# Altium schematic sheet FPGA_Config.SchDoc: FPGA
size 420 x 297 mm; Author: G.K.; CompanyName: WUT; DrawnBy: G.K.; Organization: CERN; Address1: Warsaw Univeristy of Technology; Address2: Nowowiejska 15/19; DocumentNumber: 9; Revision: -; SheetNumber: 9; SheetTotal: 10; EDA_Number: ARTIQ; Projet: Banker; ModifiedBy: -; CreateDate: XX/XX/XXXX; CheckedDate: -; Title2: Configuration; DivGrp: ISE; Designer: G.K.; ModifiedDate: -; ProjectName: ADC/DAC MEZZANINE
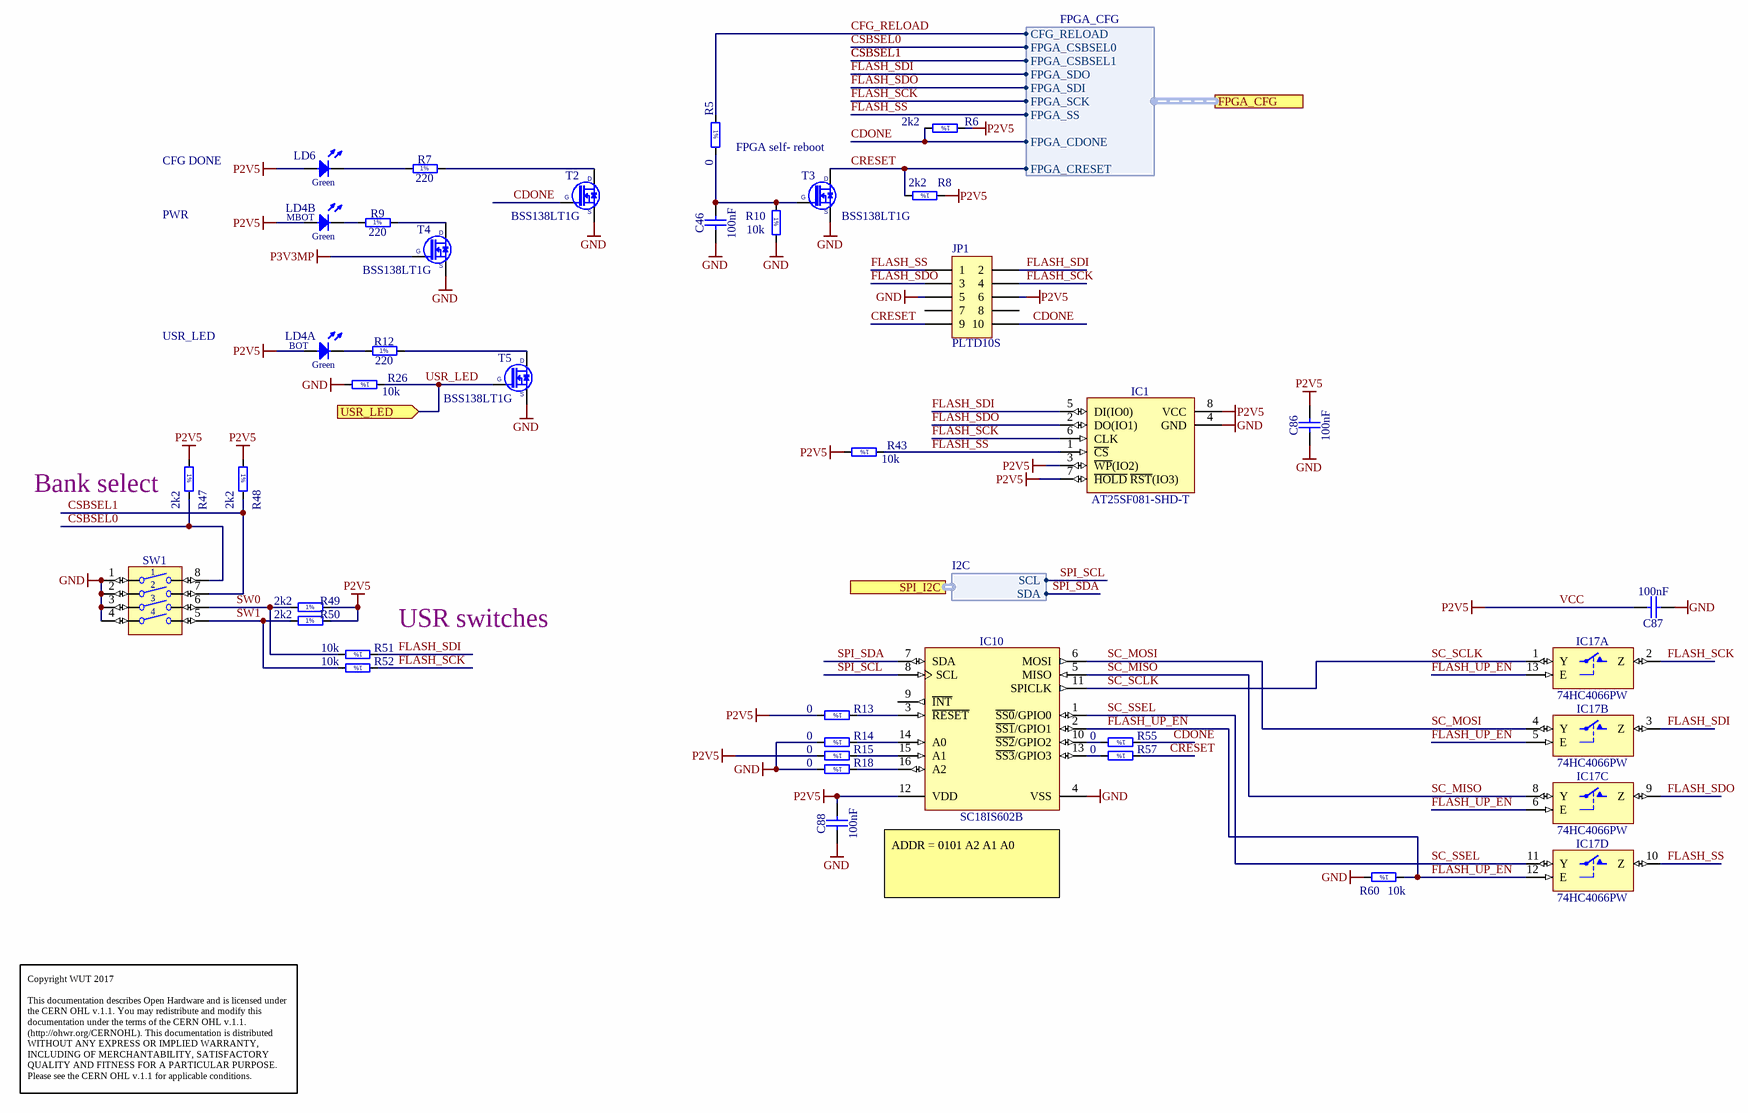
[diagram p0: FPGA_Config.SchDoc]

## Parts
C46  100nF  [CAPC1005X55N]
C86  100nF  [CAPC1005X55N]
C87  100nF  [CAPC1005X55N]
C88  100nF  [CAPC1005X55N]
IC1  AT25SF081-SHD-T  [SOIC127P790X216-8N]
IC10  SC18IS602B  [SOP65P640X110-16N]
IC17  74HC4066PW  [SOP65P640X110-14N]  (parts A,B,C,D of 4)
JP1  PLTD10S  [PLTD10S]
LD4  Green/Green/HeRed/HeRed  [LED_BIVAR_H485CHHGGDL]  (value not drawn)  (parts A,B of 4)
LD6  Green  [LED_KINGBRIGHT_KPH-1608CGCK]  (value not drawn)
R5  0  [RESC1608X55N]
R6  2k2  [RESC1005X40N]
R7  220  [RESC1608X55N]
R8  2k2  [RESC1005X40N]
R9  220  [RESC1608X55N]
R10  10k  [RESC1005X40N]
R12  220  [RESC1608X55N]
R13  0  [RESC1608X55N]
R14  0  [RESC1608X55N]
R15  0  [RESC1608X55N]
R18  0  [RESC1608X55N]
R26  10k  [RESC1005X40N]
R43  10k  [RESC1005X40N]
R47  2k2  [RESC1005X40N]
R48  2k2  [RESC1005X40N]
R49  2k2  [RESC1005X40N]
R50  2k2  [RESC1005X40N]
R51  10k  [RESC1005X40N]
R52  10k  [RESC1005X40N]
R55  0  [RESC1608X55N]
R57  0  [RESC1608X55N]
R60  10k  [RESC1005X40N]
SW1  Switch  [SW_TYCO_1571983-4]  (value not drawn)
T2  BSS138LT1G  [SOT95P240X110-3N]
T3  BSS138LT1G  [SOT95P240X110-3N]
T4  BSS138LT1G  [SOT95P240X110-3N]
T5  BSS138LT1G  [SOT95P240X110-3N]

## Ports
FPGA_CFG (harness FPGA_CFG), SPI_I2C (harness I2C), USR_LED (in)

## Harnesses
I2C: SDA, SCL
FPGA_CFG: FPGA_CSBSEL0, FPGA_CSBSEL1, FPGA_SDO, FPGA_SDI, FPGA_SCK, FPGA_SS, FPGA_CDONE, FPGA_CRESET, CFG_RELOAD

## Nets
GND: C46.1 C86.1 C87.1 C88.1 IC1.4(GND) IC10.4(VSS) IC17.7(GND) JP1.5 R10.2 R14.2 R18.2 R26.2 R60.2 SW1.1 SW1.2 SW1.3 SW1.4 T2.2(S) T3.2(S) T4.2(S) T5.2(S)
P3V3MP: T4.1(G)
VCC: C86.2 C87.2 C88.2 IC1.3(~{WP}(IO2)) IC1.7(~{HOLD}_~{RST}(IO3)) IC1.8(VCC) IC10.12(VDD) IC17.14(VCC) JP1.6 LD4.2(A) LD4.4(A) LD6.2(A) R6.1 R8.1 R13.2 R15.2 R43.2 R47.1 R48.1 R49.2 R50.2  [also labelled P2V5]
CDONE: JP1.10 R6.2 R55.1 T2.1(G) ; port FPGA_CFG.FPGA_CDONE
CFG_RELOAD: R5.1 ; port FPGA_CFG.CFG_RELOAD
CRESET: JP1.9 R8.2 R57.1 T3.3(D) ; port FPGA_CFG.FPGA_CRESET
CSBSEL0: R47.2 SW1.8 ; port FPGA_CFG.FPGA_CSBSEL0
CSBSEL1: R48.2 SW1.7 ; port FPGA_CFG.FPGA_CSBSEL1
FLASH_SCK: IC1.6(CLK) IC17.2(Z) JP1.4 R52.1 ; port FPGA_CFG.FPGA_SCK
FLASH_SDI: IC1.5(DI(IO0)) IC17.3(Z) JP1.2 R51.1 ; port FPGA_CFG.FPGA_SDO
FLASH_SDO: IC1.2(DO(IO1)) IC17.9(Z) JP1.3 ; port FPGA_CFG.FPGA_SDI
FLASH_SS: IC1.1(~{CS}) IC17.10(Z) JP1.1 R43.1 ; port FPGA_CFG.FPGA_SS
FLASH_UP_EN: IC10.2(~{SS1}/GPIO1) IC17.5(E) IC17.6(E) IC17.12(E) IC17.13(E) R60.1
SC_MISO: IC10.5(MISO) IC17.8(Y)
SC_MOSI: IC10.6(MOSI) IC17.4(Y)
SC_SCLK: IC10.11(SPICLK) IC17.1(Y)
SC_SSEL: IC10.1(~{SS0}/GPIO0) IC17.11(Y)
SPI_SCL: IC10.8(SCL) ; port SPI_I2C.SCL
SPI_SDA: IC10.7(SDA) ; port SPI_I2C.SDA
SW0: R49.1 R51.2 SW1.6
SW1: R50.1 R52.2 SW1.5
USR_LED: R26.1 T5.1(G) ; port USR_LED
NetC46_2: C46.2 R5.2 R10.1 T3.1(G)
NetIC10_3: IC10.3(~{RESET}) R13.1
NetIC10_10: IC10.10(~{SS2}/GPIO2) R55.2
NetIC10_13: IC10.13(~{SS3}/GPIO3) R57.2
NetIC10_14: IC10.14(A0) R14.1
NetIC10_15: IC10.15(A1) R15.1
NetIC10_16: IC10.16(A2) R18.1
NetLD4_1: LD4.1(C) R12.1
NetLD4_3: LD4.3(C) R9.1
NetLD6_1: LD6.1(C) R7.1
NetR7_2: R7.2 T2.3(D)
NetR9_2: R9.2 T4.3(D)
NetR12_2: R12.2 T5.3(D)

Not connected (* = marked no-connect by the designer): IC10 9(~{INT}); JP1 7 8

## Notes on the sheet
- CFG DONE
- PWR
- FPGA self- reboot
- USR_LED
- (near R47) Bank select
- USR switches
- ADDR = 0101 A2 A1 A0
- Copyright WUT 2017
  This documentation describes Open Hardware and is licensed under the CERN OHL v.1.1. You may redistribute and modify this documentation under the terms of the CERN OHL v.1.1. (http://ohwr.org/CERNOHL). This documentation is distributed WITHOUT ANY EXPRESS OR IMPLIED WARRANTY, INCLUDING OF MERCHANTABILITY, SATISFACTORY QUALITY AND FITNESS FOR A PARTICULAR PURPOSE. Please see the CERN OHL v.1.1 for applicable conditions.
- Project/Equipment
- Document
- Designer
- Drawn by
- Check.by
- File
- Last Mod.
- Print Date
- Sheet
- Size
- A3
- of
- Rev
- (in symbol LED_BIVAR_H485CHHGGDL, part A) BOT; Green
- (in symbol LED_BIVAR_H485CHHGGDL, part B) MBOT; Green
- (in symbol R0402_2K2_1%_0.0625W_100PPM) 1%
- (in symbol R0402_10K_1%_0.0625W_100PPM) 1%
- (in symbol R0603_0R_JUMPER) 1%
- (in symbol R0603_220R_1%_0.1W_100PPM) 1%

## Library data of the parts
C46 C86-C88 = CC0402_100NF_16V_10%_X5R: Non-polarised capacitor; Part Description: SMD Multilayer Chip Ceramic Capacitor; Manufacturer: GENERIC; Manufacturer1 Part Number: GRM155R61C104KA88D; Voltage: 16V; TC: X5R; Tolerance: ±10%; Part Number: CC0402_100NF_16V_10%_X5R; Component Kind: Standard; Component Type: Standard; Pin Count: 2; Value: 100nF; Status: None; Manufacturer Part Number: CC0402_100NF_16V_10%_X5R; Case: 0402; Mounted: Yes; Socket: No; SMD: Yes; Sense: No; Manufacturer1 Example: MURATA; Manufacturer1 ComponentHeight: 0.55mm; HelpURL: \\cern.ch\dfs\Applications\Altium\Datasheets\CC0402_X5R_MURATA_GRM.pdf; Author: CERN DEM JLC; CreateDate: 10.12.2013; LatestRevisionDate: 10.12.2013
IC1 = MEM_AT25SF081-SHD-T: 8M-bit Serial Flash Memory with uniform 4KB sectors and Dual/Quad SPI and QPI; Manufacturer: ADESTO; PressFit: No; Bonding: No; Part Number: AT25SF081-SHD-T; Component Kind: Standard; Component Type: Standard; Device: AT25SF081-SHD-T; PackageDescription: SOIC, 1.27mm Pitch; 8 Pin, 5.285mm W X 5.335mm L X 2.16mm H body, IPC Medium Density; Part Description: 8M-bit Serial Flash Memory with uniform 4KB sectors and Dual/Quad SPI and QPI; Manufacturer Part Number: AT25SF081-SHD-T; Pin Count: 8; Case: SOIC8; Mounted: Yes; Socket: No; SMD: Yes; Sense: No; ComponentHeight: 2.16mm; HelpURL: \\cern.ch\dfs\Applications\Altium\Datasheets\W25Q128FVSIG.pdf; Author: GK; CreateDate: 26/01/2018; LatestRevisionDate: 26/01/2018
IC10 = SC18IS602B: I2C-bus to SPI bridge; Manufacturer: NXP SEMICONDUCTORS; PressFit: No; Bonding: No; Part Number: SC18IS602B; Component Kind: Standard; Component Type: Standard; Device: SC18IS602B; PackageDescription: SOP, 0.65mm pitch; 16 pin, 4.40mm W X 5.00mm L X 1.10mm H body IPC Medium Density; Part Description: I2C-Bus to SPI Bridge; Manufacturer Part Number: SC18IS602B; Pin Count: 16; Case: TSSOP16; Mounted: Yes; Socket: No; SMD: Yes; Sense: No; ComponentHeight: 1.1mm; HelpURL: \\cern.ch\dfs\Applications\Altium\Datasheets\SC18IS602B.pdf; Author: CERN DEM MR; CreateDate: 14/12/2015; LatestRevisionDate: 14/12/2015
IC17 = 74HC4066PW: Part Description: Quad Single-Pole Single-Throw Analog Switch; Manufacturer: NXP SEMICONDUCTORS; PressFit: No; Bonding: No; Table: Standard Logic; Part Number: 74HC4066PW; Component Kind: Standard; Component Type: Standard; Device: 74HC4066PW; PackageDescription: SOP, 14-Leads, Body 4.4x5mm (max), Pitch 0.65mm, IPC Medium Density; Manufacturer Part Number: 74HC4066PW; Pin Count: 14; Case: TSSOP14; Mounted: Yes; Socket: No; SMD: Yes; ComponentHeight: 1.1mm; Author: CERN DEM JLC; HelpURL: \\cern.ch\dfs\Applications\Altium\Datasheets\74HC4066PW.pdf; CreateDate: 2014-11-19; LatestRevisionDate: 2014-11-19
JP1 = CON_2x5 2.54 male SMT: Goldpin 2.54mm, male header
LD4 = LED_BIVAR_H485CHHGGDL: LED x4 G-1C2A-BOT_G-3C4A_H-5C6A_H-7C8A-TOP; Part Description: Quad-Level 2mm (Green+Green+HeRed+HeRed) LED, PCB Edge Mounting; Manufacturer: BIVAR; PressFit: No; Bonding: No; Part Number: LED_BIVAR_H485CHHGGDL; Component Kind: Standard; Component Type: Standard; Color: Green/Green/HeRed/HeRed; PackageDescription: Quad-Level 2mm (Green+Green+HeRed+HeRed) LED, PCB Edge Mounting  BIVAR H485C Serie; Status: Not Recommended; Manufacturer Part Number: H485CHHGGDL; Pin Count: 8; Mounted: Yes; Socket: No; SMD: No; Sense: No; ComponentHeight: 11.3mm; HelpURL: \\cern.ch\dfs\Applications\Altium\Datasheets\LED_BIVAR_H485C.pdf; Author: CERN DEM BC; CreateDate: 12/11/2015; LatestRevisionDate: 12/11/2015
LD6 = LED_KINGBRIGHT_KPH-1608CGCK: LED Green 1C 2A; Part Description: SMD Green LED, Case 1.6mmX0.8mm(0603), 0.65mm Thickness; PressFit: No; Bonding: No; Part Number: LED_KINGBRIGHT_KPH-1608CGCK; Component Kind: Standard; Component Type: Standard; Color: Green; PackageDescription: SMT Green LED, Case 0603, Body L 1.6 x W 0.8mm H 0.65mm; Manufacturer: KINGBRIGHT; Manufacturer Part Number: KPH-1608CGCK; Pin Count: 2; Mounted: Yes; Socket: No; SMD: Yes; Sense: No; ComponentHeight: 0.65mm; HelpURL: \\cern.ch\dfs\Applications\Altium\Datasheets\LED_KINGBRIGHT_KPH-1608CGCK.pdf; Author: CERN DEM JLC; CreateDate: 03.07.2017; LatestRevisionDate: 03.07.2017
R5 R13-R15 R18 R55 R57 = R0603_0R_JUMPER: Resistor - 1%; Part Description: 1A (0.05R Max DC Resistance) Zero Ohm Jumper; Manufacturer: GENERIC; Manufacturer1 Part Number: NRC06Z0; Table: Resistors SMD; Part Number: R0603_0R_JUMPER; Component Kind: Standard; Component Type: Standard; Pin Count: 2; Value: 0; Status: Preferred; Manufacturer Part Number: R0603_0R_JUMPER; Case: 0603; Mounted: Yes; Socket: No; SMD: Yes; Manufacturer1 Example: NIC COMPONENT; Manufacturer1 ComponentHeight: 0.55mm; HelpURL: \\cern.ch\dfs\Applications\Altium\Datasheets\R0603_NIC_NRC.pdf; Author: CERN DEM JLC; CreateDate: 2007-12-03; LatestRevisionDate: 2008-03-13
R6 R8 R47-R50 = R0402_2K2_1%_0.0625W_100PPM: Resistor - 1%; Part Description: General Purpose Thick Film Chip Resistor; Manufacturer: GENERIC; Manufacturer1 Part Number: 232270672202L; TC: ±100ppm/°C; Table: Resistors SMD; Part Number: R0402_2K2_1%_0.0625W_100PPM; Component Kind: Standard; Component Type: Standard; Pin Count: 2; Value: 2k2; Status: Not recommended; Power: 0.0625W; Tolerance: ±1%; Manufacturer Part Number: R0402_2K2_1%_0.0625W_100PPM; Case: 0402; Mounted: Yes; Socket: No; SMD: Yes; Manufacturer1 Example: YAGEO PHYCOMP; Manufacturer1 ComponentHeight: 0.4mm; HelpURL: \\cern.ch\dfs\Applications\Altium\Datasheets\R0402_Phycomp_RC0402.pdf; Author: CERN DEM JLC; CreateDate: 2007-12-03; LatestRevisionDate: 2012-10-17
R7 R9 R12 = R0603_220R_1%_0.1W_100PPM: Resistor - 1%; Part Description: General Purpose Thick Film Chip Resistor; Manufacturer: GENERIC; Manufacturer1 Part Number: NRC06F2200TRF; Power: 0.1W; TC: ±100ppm/°C; Part Number: R0603_220R_1%_0.1W_100PPM; Component Kind: Standard; Component Type: Standard; Pin Count: 2; Value: 220; Status: Preferred; Tolerance: ±1%; Manufacturer Part Number: R0603_220R_1%_0.1W_100PPM; Case: 0603; Mounted: Yes; Sense: No; Socket: No; SMD: Yes; Manufacturer1 Example: NIC COMPONENT; Manufacturer1 ComponentHeight: 0.55mm; HelpURL: \\cern.ch\dfs\Applications\Altium\Datasheets\R0603_NIC_NRC.pdf; Author: CERN DEM JLC; CreateDate: 03.12.2007; LatestRevisionDate: 13.03.2008
R10 R26 R43 R51 R52 R60 = R0402_10K_1%_0.0625W_100PPM: Resistor - 1%; Part Description: General Purpose Thick Film Chip Resistor; Manufacturer: GENERIC; Manufacturer1 Part Number: 232270671003L; TC: ±100ppm/°C; Table: Resistors SMD; Part Number: R0402_10K_1%_0.0625W_100PPM; Component Kind: Standard; Component Type: Standard; Pin Count: 2; Value: 10k; Status: Not recommended; Power: 0.0625W; Tolerance: ±1%; Manufacturer Part Number: R0402_10K_1%_0.0625W_100PPM; Case: 0402; Mounted: Yes; Socket: No; SMD: Yes; Manufacturer1 Example: YAGEO PHYCOMP; Manufacturer1 ComponentHeight: 0.4mm; HelpURL: \\cern.ch\dfs\Applications\Altium\Datasheets\R0402_Phycomp_RC0402.pdf; Author: CERN DEM JLC; CreateDate: 2007-12-03; LatestRevisionDate: 2012-10-17
SW1 = SW_TYCO_1571983-4: 4 Ways SPST DIP Switch; Part Description: 4 Way SPST SMD DIP Switch, Latched, Contact Rating 0.025A 24VDC; Manufacturer: TYCO; Manufacturer Part Number: 1571983-4 or GDH04S04; PressFit: No; Part Number: SW_TYCO_1571983-4; Component Kind: Standard; Component Type: Standard; Pin Count: 8; PackageDescription: Pitch 1.27mm,  Body 6.2x6.2mm, 4 Ways SPST Surface-Mount DIP Switch, TYCO GDH Series; Family: Switch; Mounted: Yes; Socket: No; SMD: Yes; Sense: No; Status: None; ComponentHeight: 2.31mm; HelpURL: \\cern.ch\dfs\Applications\Altium\Datasheets\SW_TYCO_1571983-4.pdf; Author: CERN DEM JLC; CreateDate: 08/01/2009; LatestRevisionDate: 08/01/2009
T2-T5 = BSS138LT1G: N-CHANNEL MOSFET WITH DIODE; Part Description: 50V 200mA N-Channel Enhancement Mode Field-Effect Transistor; Manufacturer: ON SEMICONDUCTOR; PressFit: No; Bonding: No; Part Number: BSS138LT1G; Component Kind: Standard; Component Type: Standard; Device: BSS138LT1G; PackageDescription: SOT23 3-Leads, Pitch 0.95mm - Body 1.4x3mm, IPC Medium Density; Manufacturer Part Number: BSS138LT1G; Pin Count: 3; Case: SOT23-3; Mounted: Yes; Socket: No; SMD: Yes; Sense: No; ComponentHeight: 1.11mm; HelpURL: \\cern.ch\dfs\Applications\Altium\Datasheets\BSS138LT1G.pdf; Author: CERN DEM JLC; CreateDate: 23/03/2009; LatestRevisionDate: 23/03/2009